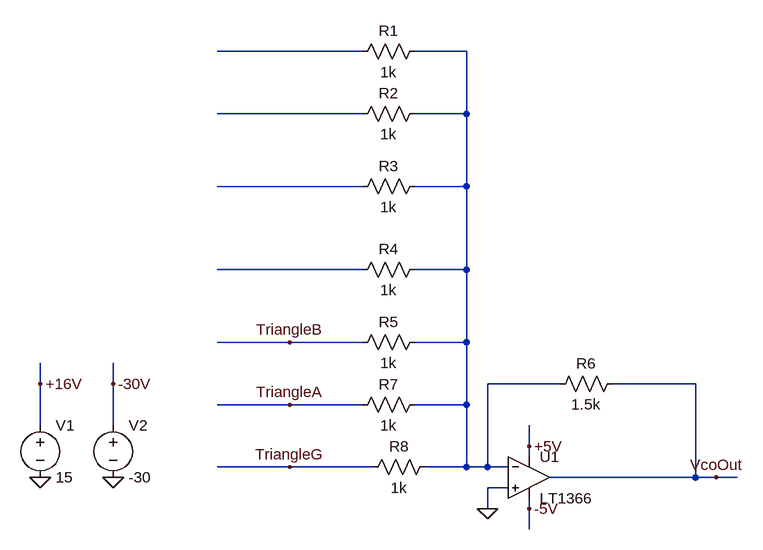
[diagram p0: schematic Summing Amplifier.asc]
Summing Amplifier.asc, the LTspice schematic file:
Version 4
SHEET 1 1000 728
WIRE 400 -32 176 -32
WIRE 560 -32 480 -32
WIRE 400 64 176 64
WIRE 560 64 560 -32
WIRE 560 64 480 64
WIRE 400 176 176 176
WIRE 560 176 560 64
WIRE 560 176 480 176
WIRE 400 304 176 304
WIRE 560 304 560 176
WIRE 560 304 480 304
WIRE 288 416 176 416
WIRE 400 416 288 416
WIRE 560 416 560 304
WIRE 560 416 480 416
WIRE -96 480 -96 448
WIRE 16 480 16 448
WIRE 704 480 592 480
WIRE 912 480 784 480
WIRE 288 512 176 512
WIRE 400 512 288 512
WIRE 560 512 560 416
WIRE 560 512 480 512
WIRE -96 544 -96 480
WIRE 16 544 16 480
WIRE 656 576 656 544
WIRE 656 592 656 576
WIRE 288 608 176 608
WIRE 416 608 288 608
WIRE 560 608 560 512
WIRE 560 608 496 608
WIRE 592 608 592 480
WIRE 592 608 560 608
WIRE 624 608 592 608
WIRE 912 624 912 480
WIRE 912 624 688 624
WIRE 944 624 912 624
WIRE 976 624 944 624
WIRE 624 640 592 640
WIRE 592 672 592 640
WIRE 656 672 656 656
WIRE 656 704 656 672
FLAG 656 576 +5V
FLAG 656 672 -5V
FLAG 592 672 0
FLAG 944 624 VcoOut
FLAG -96 624 0
FLAG -96 480 +16V
FLAG 16 624 0
FLAG 16 480 -30V
FLAG 288 608 TriangleG
FLAG 288 512 TriangleA
FLAG 288 416 TriangleB
SYMBOL Opamps/LT1366 656 560 R0
SYMATTR InstName U1
SYMBOL res 496 -48 R90
WINDOW 0 0 56 VBottom 2
WINDOW 3 32 56 VTop 2
SYMATTR InstName R1
SYMATTR Value 1k
SYMBOL res 496 48 R90
WINDOW 0 0 56 VBottom 2
WINDOW 3 32 56 VTop 2
SYMATTR InstName R2
SYMATTR Value 1k
SYMBOL res 496 160 R90
WINDOW 0 0 56 VBottom 2
WINDOW 3 32 56 VTop 2
SYMATTR InstName R3
SYMATTR Value 1k
SYMBOL res 496 288 R90
WINDOW 0 0 56 VBottom 2
WINDOW 3 32 56 VTop 2
SYMATTR InstName R4
SYMATTR Value 1k
SYMBOL res 496 400 R90
WINDOW 0 0 56 VBottom 2
WINDOW 3 32 56 VTop 2
SYMATTR InstName R5
SYMATTR Value 1k
SYMBOL voltage -96 528 R0
SYMATTR InstName V1
SYMATTR Value 15
SYMBOL voltage 16 528 R0
SYMATTR InstName V2
SYMATTR Value -30
SYMBOL res 800 464 R90
WINDOW 0 0 56 VBottom 2
WINDOW 3 32 56 VTop 2
SYMATTR InstName R6
SYMATTR Value 1.5k
SYMBOL res 496 496 R90
WINDOW 0 0 56 VBottom 2
WINDOW 3 32 56 VTop 2
SYMATTR InstName R7
SYMATTR Value 1k
SYMBOL res 512 592 R90
WINDOW 0 0 56 VBottom 2
WINDOW 3 32 56 VTop 2
SYMATTR InstName R8
SYMATTR Value 1k

The netlist it stands for:
* Summing Amplifier.asc
XU1 0 N002 +5V -5V VcoOut LT1366  ; pins In+ In- V+ V- OUT
R1 N002 N001 1k
R2 N002 N003 1k
R3 N002 N004 1k
R4 N002 N005 1k
R5 N002 TriangleB 1k
V1 +16V 0 15
V2 -30V 0 -30
R6 VcoOut N002 1.5k
R7 N002 TriangleA 1k
R8 N002 TriangleG 1k
.lib LTC.lib
.backanno
.end